# EAGLE schematic slave-V11 (EAGLE 6.5.0)
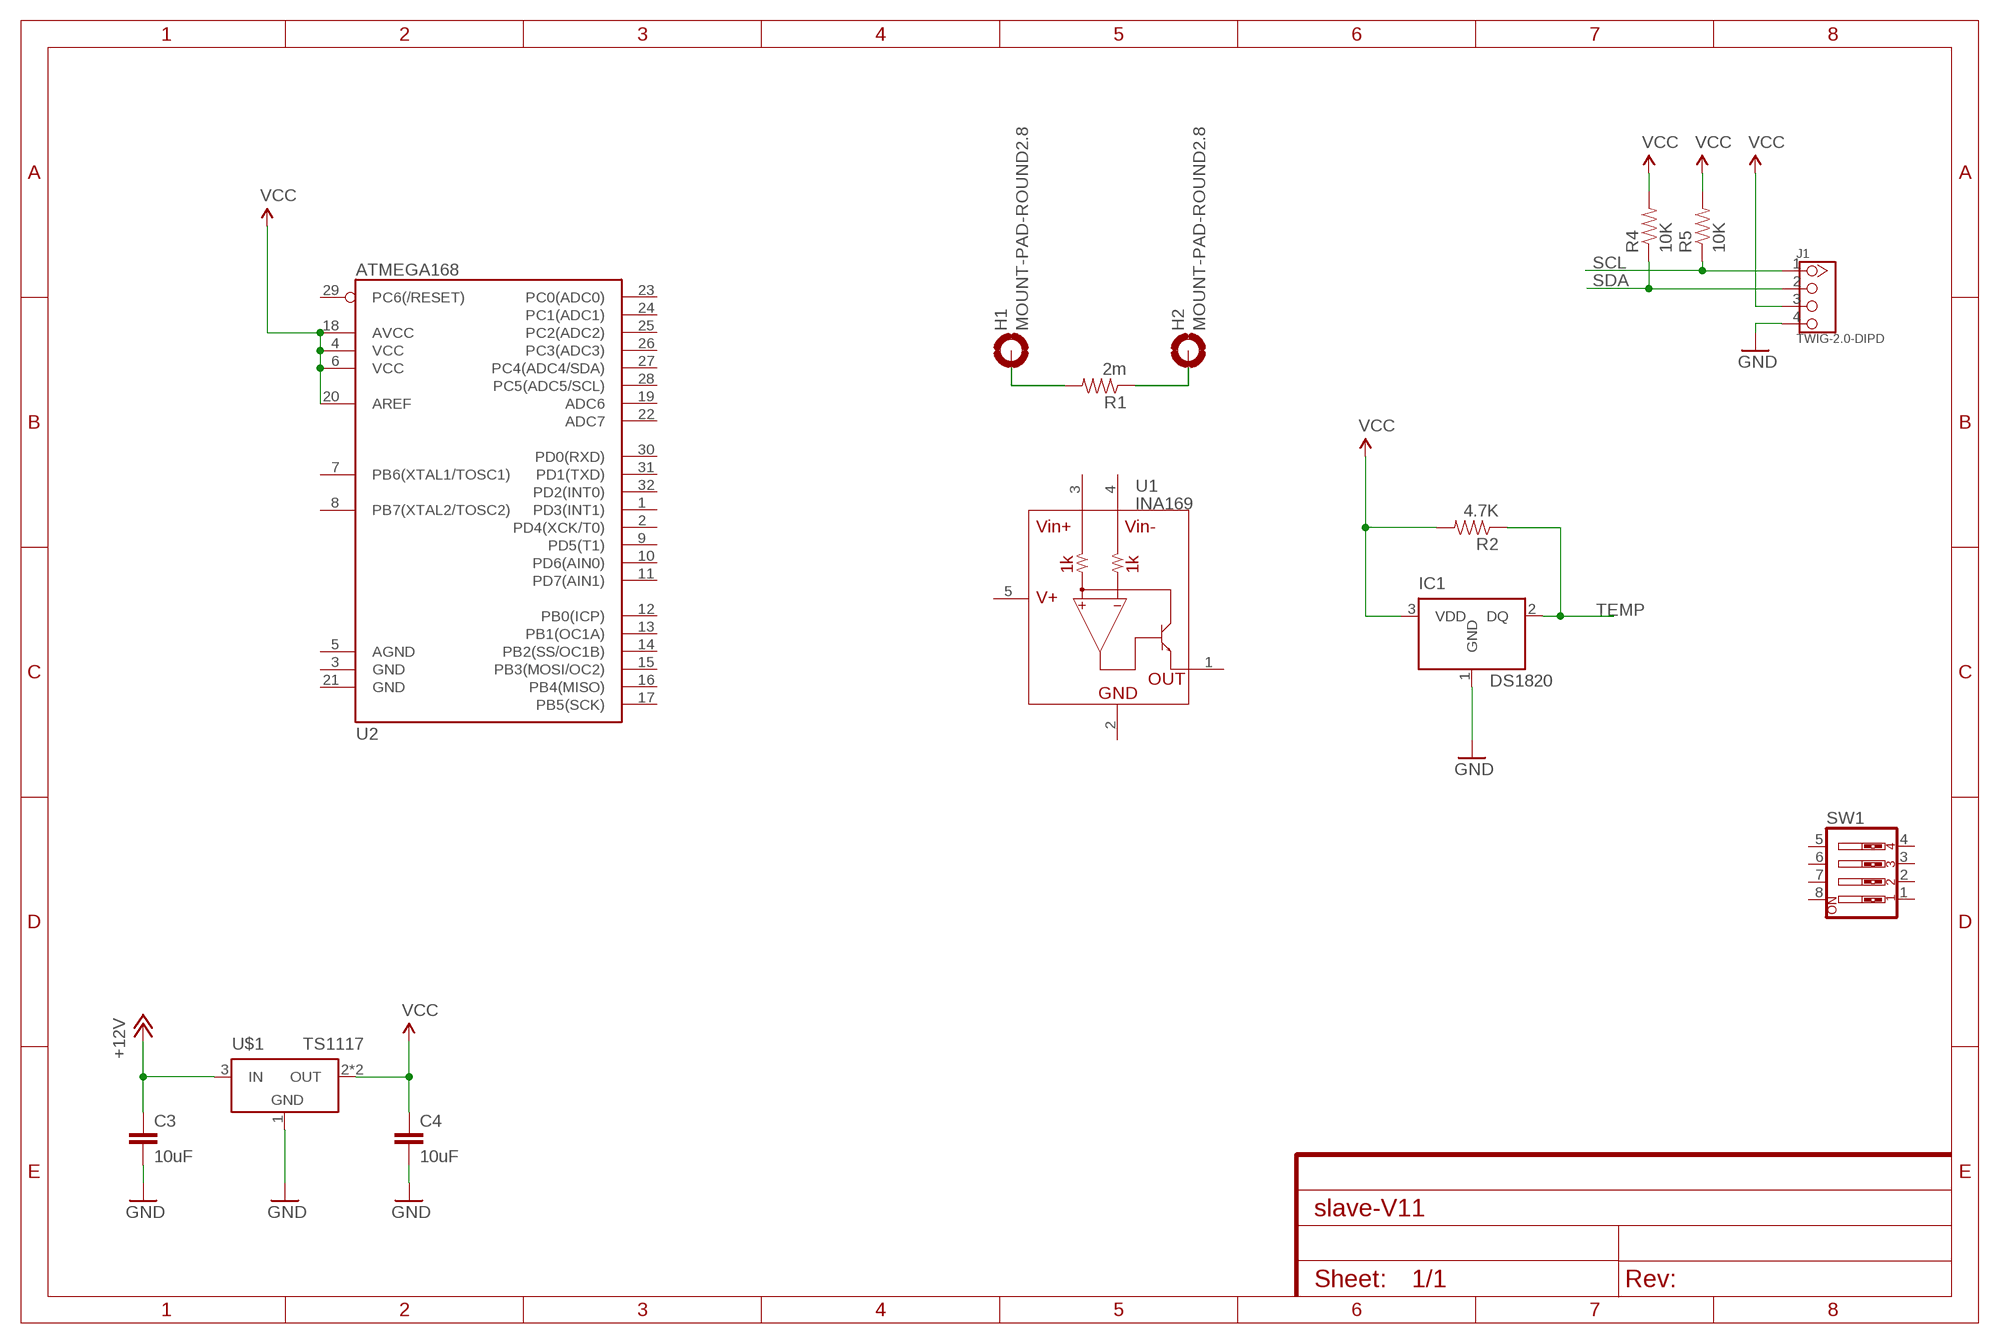
[diagram p0: schematic, sheet 1]

## Parts
C3  10uF  CAP0805  [0805]
C4  10uF  CAP0805  [0805]
H1  MOUNT-PAD-ROUND2.8  [2,8-PAD]
H2  MOUNT-PAD-ROUND2.8  [2,8-PAD]
IC1  DS1820  [TO-92]
J1  TWIG-2.0-DIPD  [2.0_1X4_90]
R1  2m  RESISTOR2512  [R2512]
R2  4.7K  RESISTOR0805-RES  [0805]
R4  10K  RESISTOR0805-RES  [0805]
R5  10K  RESISTOR0805-RES  [0805]
SW1  SW_DIP-4  [EDG-04]
U1  INA169  [SOT23-5]
U2  ATMEGA168  [TQFP32-08]
U$1  TS1117  [SOT223]

## Nets
+12V: C3.1 U$1.3(IN)
GND: C3.2 C4.2 IC1.1(GND) J1.4 U$1.1(GND)
SCL: J1.1 R5.1
SDA: J1.2 R4.1
TEMP: IC1.2(DQ) R2.1
VCC: C4.1 IC1.3(VDD) J1.3 R2.2 R4.2 R5.2 U2.4(VCC) U2.6(VCC) U2.18(AVCC) U2.20(AREF) U$1.2(OUT) U$1.4(OUT)
VIN+: H1.B2,8(MOUNT) R1.2
VIN-: H2.B2,8(MOUNT) R1.1
Unconnected: SW1.1 SW1.2 SW1.3 SW1.4 SW1.5 SW1.6 SW1.7 SW1.8 U1.1(OUT) U1.2(GND) U1.3(VIN+) U1.4(VIN-) U1.5(V+) U2.1(PD3(INT1)) U2.2(PD4(XCK/T0)) U2.3(GND) U2.5(AGND) U2.7(PB6(XTAL1/TOSC1)) U2.8(PB7(XTAL2/TOSC2)) U2.9(PD5(T1)) U2.10(PD6(AIN0)) U2.11(PD7(AIN1)) U2.12(PB0(ICP)) U2.13(PB1(OC1A)) U2.14(PB2(SS/OC1B)) U2.15(PB3(MOSI/OC2)) U2.16(PB4(MISO)) U2.17(PB5(SCK)) U2.19(ADC6) U2.21(GND) U2.22(ADC7) U2.23(PC0(ADC0)) U2.24(PC1(ADC1)) U2.25(PC2(ADC2)) U2.26(PC3(ADC3)) U2.27(PC4(ADC4/SDA)) U2.28(PC5(ADC5/SCL)) U2.29(PC6(/RESET)) U2.30(PD0(RXD)) U2.31(PD1(TXD)) U2.32(PD2(INT0))

## Library data of the parts
C3 C4 = SparkFun-Passives:CAP: Capacitor Standard 0603 ceramic capacitor, and 0.1" leaded capacitor.
H1 H2 = holes:MOUNT-PAD-ROUND: MOUNTING PAD, round
IC1 = DS1820:DS1820: DS1820 - 1-Wire Digital Thermometer
J1 = Connector:TWIG-2.0-DIP
R1 R2 R4 R5 = SparkFun-Passives:RESISTOR: Resistor Basic schematic elements and footprints for 0603, 1206, and PTH resistors.
SW1 = special:SW_DIP-4: DIP SWITCH
U1 = SparkFun-AnalogIC:INA169
U2 = SparkFun-DigitalIC:ATMEGA168: Atmel 32-pin 8-bit micro, 16k flash.
U$1 = MeineLIB:TS1117